# Altium schematic sheet BoardConnectors.SchDoc
size 393 x 279 mm; DrawnBy: Gustav Eckerbom; SheetNumber: 2; SheetTotal: 6; Project: alife7-genx320cam; Project revision: Rev 1; Sheet Name: BoardConnectors; Sheet size: A3
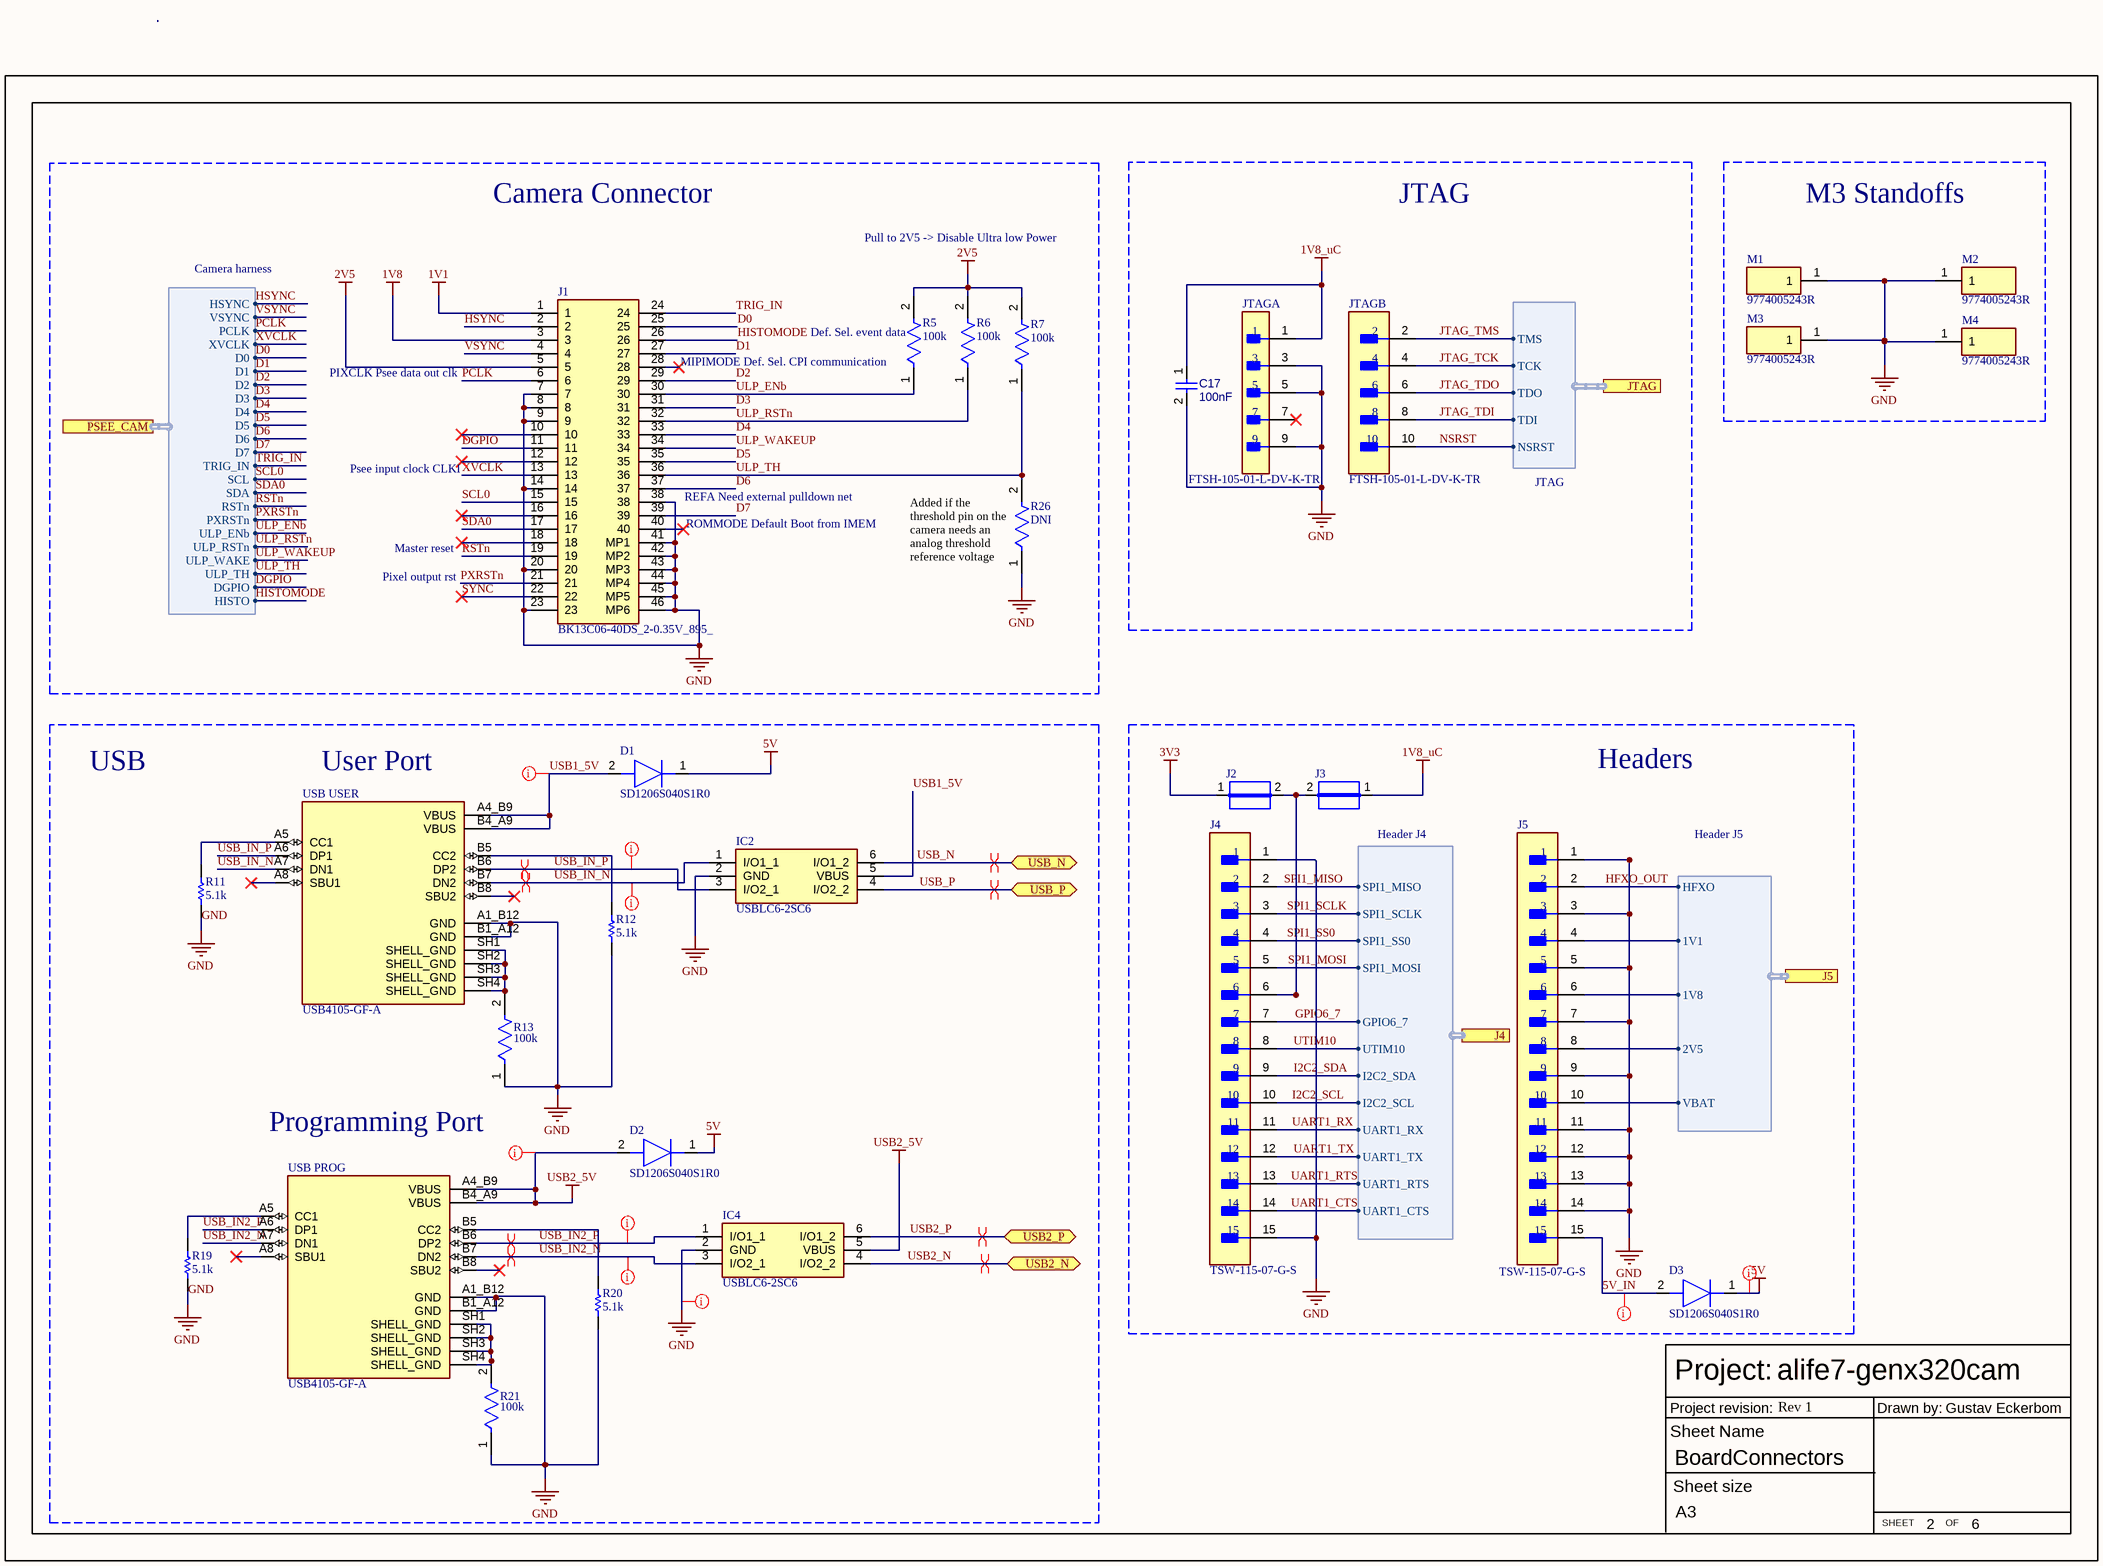
[diagram p0: BoardConnectors.SchDoc]

## Parts
C17  100nF  [FP-C0603X104K3RACTU-IPC_C]
D1  SD1206S040S1R0  [DIOC3419X116N]
D2  SD1206S040S1R0  [DIOC3419X116N]
D3  SD1206S040S1R0  [DIOC3419X116N]
IC2  USBLC6-2SC6  [SOT95P280X145-6N]
IC4  USBLC6-2SC6  [SOT95P280X145-6N]
J1  BK13C06-40DS_2-0.35V_895_  [BK13C0640DS2035V895]
J2  JUMPER  [JUMPER]  (value not drawn)
J3  JUMPER  [JUMPER]  (value not drawn)
J4  TSW-115-07-G-S  [FP-TSW-115-07-G-S-MFG]
J5  TSW-115-07-G-S  [FP-TSW-115-07-G-S-MFG]
JTAG  FTSH-105-01-L-DV-K-TR  [FP-FTSH-105-01-L-DV-K-TR-MFG]  (parts A,B of 2)
M1  9774005243R  [9774005243R]
M2  9774005243R  [9774005243R]
M3  9774005243R  [9774005243R]
M4  9774005243R  [9774005243R]
R5  100k  [FP-RC0603-0_55-IPC_B]
R6  100k  [FP-RC0603-0_55-IPC_B]
R7  100k  [FP-RC0603-0_55-IPC_B]
R11  5.1k  [RESC1608X55X30LL15T15]
R12  5.1k  [RESC1608X55X30LL15T15]
R13  100k  [FP-RC0603-0_55-IPC_C]
R19  5.1k  [RESC1608X55X30LL15T15]
R20  5.1k  [RESC1608X55X30LL15T15]
R21  100k  [FP-RC0603-0_55-IPC_B]
R26  DNI  [FP-RC0603-0_55-IPC_B]
USB_PROG  USB4105-GF-A  [GCT_USB4105-GF-A]
USB_USER  USB4105-GF-A  [GCT_USB4105-GF-A]

## Blocks framed on the sheet
Camera Connector: J1 R5-R7 R26
JTAG: C17 JTAG
M3 Standoffs: M1-M4
Headers: D3 J2-J5

## Ports
J4 (harness Header J4), J5 (harness Header J5), JTAG (harness JTAG), PSEE_CAM (harness Camera harness), USB2_N (bidir), USB2_P (bidir), USB_N (bidir), USB_P (bidir)

## Harnesses
JTAG: TMS, TCK, TDO, TDI, NSRST
Camera harness: HSYNC, VSYNC, PCLK, XVCLK, D0, D1, D2, D3, D4, D5, D6, D7, SCL, SDA, RSTn, PXRSTn, ULP_ENb, ULP_RSTn, ULP_WAKE, ULP_TH, DGPIO, HISTO, TRIG_IN
Header J5: HFXO, 1V1, 2V5, 1V8, VBAT
Header J4: SPI1_MOSI, GPIO6_7, UTIM10, I2C2_SDA, UART1_TX, UART1_RX, I2C2_SCL, SPI1_SS0, SPI1_MISO, SPI1_SCLK, UART1_RTS, UART1_CTS

## Nets
1V1: J1.1
1V8: J1.3
1V8_uC: C17.1 J3.1 JTAG.1
2V5: J1.5 R5.2 R6.2 R7.2
3V3: J2.1
5V: D1.1(K) D2.1(K) D3.1(K)
GND: C17.2 IC2.2(GND) IC4.2(GND) J1.7 J1.8 J1.9 J1.14 J1.20 J1.23 J1.38 J1.41(MP1) J1.42(MP2) J1.43(MP3) J1.44(MP4) J1.45(MP5) J1.46(MP6) J4.1 J4.15 J5.1 J5.3 J5.5 J5.7 J5.9 J5.11 J5.12 J5.13 J5.14 JTAG.3 JTAG.5 JTAG.9 M1.1 M2.1 M3.1 M4.1 R11.1 R12.1 R13.1 R19.1 R20.1 R21.1 R26.1 USB_PROG.A1_B12(GND) USB_PROG.B1_A12(GND) USB_USER.A1_B12(GND) USB_USER.B1_A12(GND)
USB2_5V: D2.2(A) IC4.5(VBUS) USB_PROG.A4_B9(VBUS) USB_PROG.B4_A9(VBUS)
5V_IN: D3.2(A) J5.15
D0: J1.25 ; port PSEE_CAM.D0
D1: J1.27 ; port PSEE_CAM.D1
D2: J1.29 ; port PSEE_CAM.D2
D3: J1.31 ; port PSEE_CAM.D3
D4: J1.33 ; port PSEE_CAM.D4
D5: J1.35 ; port PSEE_CAM.D5
D6: J1.37 ; port PSEE_CAM.D6
D7: J1.39 ; port PSEE_CAM.D7
DGPIO: J1.11 ; port PSEE_CAM.DGPIO
GPIO6_7: J4.7 ; port J4.GPIO6_7
HFXO_OUT: J5.2 ; port J5.HFXO
HISTOMODE: J1.26 ; port PSEE_CAM.HISTO
HSYNC: J1.2 ; port PSEE_CAM.HSYNC
I2C2_SCL: J4.10 ; port J4.I2C2_SCL
I2C2_SDA: J4.9 ; port J4.I2C2_SDA
JTAG_TCK: JTAG.4 ; port JTAG.TCK
JTAG_TDI: JTAG.8 ; port JTAG.TDI
JTAG_TDO: JTAG.6 ; port JTAG.TDO
JTAG_TMS: JTAG.2 ; port JTAG.TMS
NSRST: JTAG.10 ; port JTAG.NSRST
PCLK: J1.6 ; port PSEE_CAM.PCLK
PXRSTn: J1.21 ; port PSEE_CAM.PXRSTn
RSTn: J1.19 ; port PSEE_CAM.RSTn
SCL0: J1.15 ; port PSEE_CAM.SCL
SDA0: J1.17 ; port PSEE_CAM.SDA
SPI1_MISO: J4.2 ; port J4.SPI1_MISO
SPI1_MOSI: J4.5 ; port J4.SPI1_MOSI
SPI1_SCLK: J4.3 ; port J4.SPI1_SCLK
SPI1_SS0: J4.4 ; port J4.SPI1_SS0
SYNC: J1.22
TRIG_IN: J1.24 ; port PSEE_CAM.TRIG_IN
UART1_CTS: J4.14 ; port J4.UART1_CTS
UART1_RTS: J4.13 ; port J4.UART1_RTS
UART1_RX: J4.11 ; port J4.UART1_RX
UART1_TX: J4.12 ; port J4.UART1_TX
ULP_ENb: J1.30 R5.1 ; port PSEE_CAM.ULP_ENb
ULP_RSTn: J1.32 R6.1 ; port PSEE_CAM.ULP_RSTn
ULP_TH: J1.36 R7.1 R26.2 ; port PSEE_CAM.ULP_TH
ULP_WAKEUP: J1.34 ; port PSEE_CAM.ULP_WAKE
USB1_5V: D1.2(A) IC2.5(VBUS) USB_USER.A4_B9(VBUS) USB_USER.B4_A9(VBUS)
USB2_N: IC4.4(I/O2_2) ; port USB2_N
USB2_P: IC4.6(I/O1_2) ; port USB2_P
USB_IN2_N: IC4.3(I/O2_1) USB_PROG.A7(DN1) USB_PROG.B7(DN2)
USB_IN2_P: IC4.1(I/O1_1) USB_PROG.A6(DP1) USB_PROG.B6(DP2)
USB_IN_N: IC2.1(I/O1_1) USB_USER.A7(DN1) USB_USER.B7(DN2)
USB_IN_P: IC2.3(I/O2_1) USB_USER.A6(DP1) USB_USER.B6(DP2)
USB_N: IC2.6(I/O1_2) ; port USB_N
USB_P: IC2.4(I/O2_2) ; port USB_P
UTIM10: J4.8 ; port J4.UTIM10
VSYNC: J1.4 ; port PSEE_CAM.VSYNC
XVCLK: J1.13 ; port PSEE_CAM.XVCLK
NetJ2_2: J2.2 J3.2 J4.6
NetJ5_4: J5.4 ; port J5.1V1
NetJ5_6: J5.6 ; port J5.1V8
NetJ5_8: J5.8 ; port J5.2V5
NetJ5_10: J5.10 ; port J5.VBAT
NetR11_2: R11.2 USB_USER.A5(CC1)
NetR12_2: R12.2 USB_USER.B5(CC2)
NetR13_2: R13.2 USB_USER.SH1(SHELL_GND) USB_USER.SH2(SHELL_GND) USB_USER.SH3(SHELL_GND) USB_USER.SH4(SHELL_GND)
NetR19_2: R19.2 USB_PROG.A5(CC1)
NetR20_2: R20.2 USB_PROG.B5(CC2)
NetR21_2: R21.2 USB_PROG.SH1(SHELL_GND) USB_PROG.SH2(SHELL_GND) USB_PROG.SH3(SHELL_GND) USB_PROG.SH4(SHELL_GND)

Not connected (* = marked no-connect by the designer): J1 10* 12* 16* 18* 28* 40*; JTAG 7*; USB_PROG A8(SBU1)* B8(SBU2)*; USB_USER A8(SBU1)* B8(SBU2)*

## Layout directives
differential pair: USB2_N, USB2_P, USB_IN2_N, USB_IN2_P, USB_IN_N, USB_IN_P, USB_N, USB_P
net class Power: 5V, 5V_IN, GND, USB1_5V, USB2_5V
net class Diffpair: USB_IN2_N, USB_IN2_P, USB_IN_N, USB_IN_P

## Notes on the sheet
- Pull to 2V5 -> Disable Ultra low Power
- (near R5) MIPIMODE Def. Sel. CPI communication
- (near R5) Def. Sel. event data
- PIXCLK Psee data out clk
- Psee input clock CLKI
- (near J1) REFA Need external pulldown net
- Master reset
- (near J1) ROMMODE Default Boot from IMEM
- (near R26) Added if the threshold pin on the camera needs an analog threshold reference voltage
- Pixel output rst
- USB
- (near USB_USER) User Port
- Programming Port
- Project:
- Sheet Name
- Project revision:
- Drawn by:
- Sheet size
- SHEET
- OF

## Library data of the parts
C17 = CMP-001-00090-1: Ceramic Capacitor, Multilayer, Ceramic, 25V, 10% +Tol, 10% -Tol, X7R, 15% TC, 0.1uF, Surface Mount, 0603; RoHS Compliant: Yes; Case/Package: 0603; Max Operating Temperature: 125°C; Min Operating Temperature: -55°C; Capacitor Type: Ceramic; Mounting Technology: Surface Mount; Pins: 2; Value: 100nF
D1-D3 = SD1206S040S1R0: Diode; Manufacturer_Name: Kyocera AVX; Datasheet Link: https://componentsearchengine.com/Datasheets/1/SD1206S040S1R0.pdf; Height: 1.16mm; Manufacturer_Part_Number: SD1206S040S1R0; Mouser Part Number: 581-SD1206S040S1R0; Mouser Price/Stock: https://www.mouser.co.uk/ProductDetail/KYOCERA-AVX/SD1206S040S1R0?qs=jCA%252BPfw4LHZ%2FRBugmNm8zw%3D%3D; Arrow Part Number: SD1206S040S1R0; Arrow Price/Stock: https://www.arrow.com/en/products/sd1206s040s1r0/avx
IC2 IC4 = USBLC6-2SC6: Integrated Circuit; Manufacturer_Name: STMicroelectronics; Datasheet Link: http://www.st.com/st-web-ui/static/active/en/resource/technical/document/datasheet/CD00050750.pdf; Height: 1.45mm; Manufacturer_Part_Number: USBLC6-2SC6; Mouser Part Number: 511-USBLC6-2SC6; Mouser Price/Stock: https://www.mouser.co.uk/ProductDetail/STMicroelectronics/USBLC6-2SC6?qs=po45yt2pPpu%2FhNIlwQdTlg%3D%3D; Arrow Part Number: USBLC6-2SC6; Arrow Price/Stock: https://www.arrow.com/en/products/usblc6-2sc6/stmicroelectronics?utm_currency=USD&region=europe
J1 = BK13C06-40DS_2-0.35V_895_: Connector; Manufacturer_Name: Hirose; Manufacturer_Part_Number: BK13C06-40DS/2-0.35V(895); Datasheet Link: https://www.hirose.com/en/product/document?clcode=CL0480-0666-0-95&productname=BK13C06-40DS%2f2-0.35V(895)&series=BK13C&documenttype=2DDrawing&lang=en&documentid=BK13C06-40DS2-0.35V(895)_4800666095_2D_ENG; Height: 0.65mm; Mouser Part Number: 798-BK13C0640DS35V89; Mouser Price/Stock: https://www.mouser.co.uk/ProductDetail/Hirose-Connector/BK13C06-40DS-2-0.35V895?qs=TuK3vfAjtkUd%2FKM0cID%2Fnw%3D%3D
J2 J3 = CMP-009-00061-2: Pins: 2
J4 J5 = CMP-02766-000090-1: CONN HEADER VERT 15POS 2.54MM; Manufacturer: SAMTEC; Conn Gender: Male; Number Of Contacts: 15; Conn Orientation: Vertical; Package: TSW-115-07-G-S; RoHS: TRUE; Manufacturer Part Number: TSW-115-07-G-S; Digikey Description: CONN HEADER VERT 15POS 2.54MM; Device Class L1: Connectors; Temperature Range Low: -55°C; Height: 8.71mm; Contact Material: Gold,Nickel; ComponentLink2URL: http://suddendocs.samtec.com/catalog_english/tsw_th.pdf; ComponentLink2Description: Datasheet; Category: Conn; Footprint Url: http://suddendocs.samtec.com/prints/tsw-xxx-xx-x-x-xx-xxx-footprint.pdf; Lead Free: Yes; Octopart: https://octopart.com/tsw-115-07-g-s-samtec-272210; Pitch: 2.54mm; Device Class L2: Headers and Wire Housings; Temperature: -55°C to +125°C; Number Of Rows: 1; Automotive: No; Device Class L3: unset; Temperature Range High: +125°C
JTAG = CMP-2000-06293-2: CONN HEADER SMD 10POS 1.27MM; Max Current Rating: 1.75A; Number of Contacts: 10; Gender: Male; Row Spacing: 0.05inch; Connector Type: Male Pin; Housing Color: Black; Min Operating Temperature: -55°C; Depth: 3.43mm; Color: Black; Contact Plating: Gold; REACH SVHC: No SVHC; Packaging: Tape and Reel; Current Rating: 1.75A; Radiation Hardening: No; Package Quantity: 550; Number of Positions: 10; Max Operating Temperature: 125°C; Orientation: Straight; Termination: Solder; Contact Mating Length: 0.12inch; Number of Rows: 2; Lead Free: Lead Free; Contact Material: Bronze; Mount: Surface Mount; Housing Material: Polymer; Pitch: 1.27mm; Length: 6.35mm
M1-M4 = 9774005243R: Connector; Manufacturer_Name: Wurth Elektronik; Datasheet Link: https://www.mouser.co.uk/datasheet/2/445/9774005243R-2891020.pdf; Height: 1.55mm; Manufacturer_Part_Number: 9774005243R; Mouser Part Number: 710-9774005243R; Mouser Price/Stock: https://www.mouser.co.uk/ProductDetail/Wurth-Elektronik/9774005243R?qs=iLbezkQI%252BsiIYJ%2FPXNpHjA%3D%3D
R5-R7 R13 R21 R26 = CMP-03412-037829-1: RES 100K OHM 1% 1/10W 0603; Resistance: 100kR; Voltage Rating (DC): 50V; Temperature Coefficient: 100ppm/°C; Power Rating: 100mW; Resistance Tolerance: 1%; Case Code (Metric): 1608; RoHS Compliant: Yes; Case/Package: 0603; Resistor Type: Thick Film; Length: 1.6mm; Depth: 0.8mm; Max Operating Temperature: 155°C; Tolerance: 1%; Series: RC; Contact Plating: Tin; Width: 0.8mm; Case Code (Imperial): 0603; Number of Pins: 2; Construction: Rectangular; Termination: SMD/SMT; Military Standard: Not; Voltage Rating: 50V; Height: 0.45mm; Packaging: Tape and Reel; Min Operating Temperature: -55°C
R11 R12 R19 R20 = CMP-2000-00803-1: Part Number: ERJ-3GEYJ512V; Manufacturer: Panasonic
USB_PROG USB_USER = CMP-003-000000-2: MF: {'manufacturer': u'GCT'}; Price: None; MP: USB4105-GF-A; Value: *; Design Item ID: USB4105-GF-A; Component Type: Standard; Source: USB4105-GF-A.SchLib; Pin Count: 16; Package: None; Availability: Unavailable